# Altium project mainbroad.PrjPCB
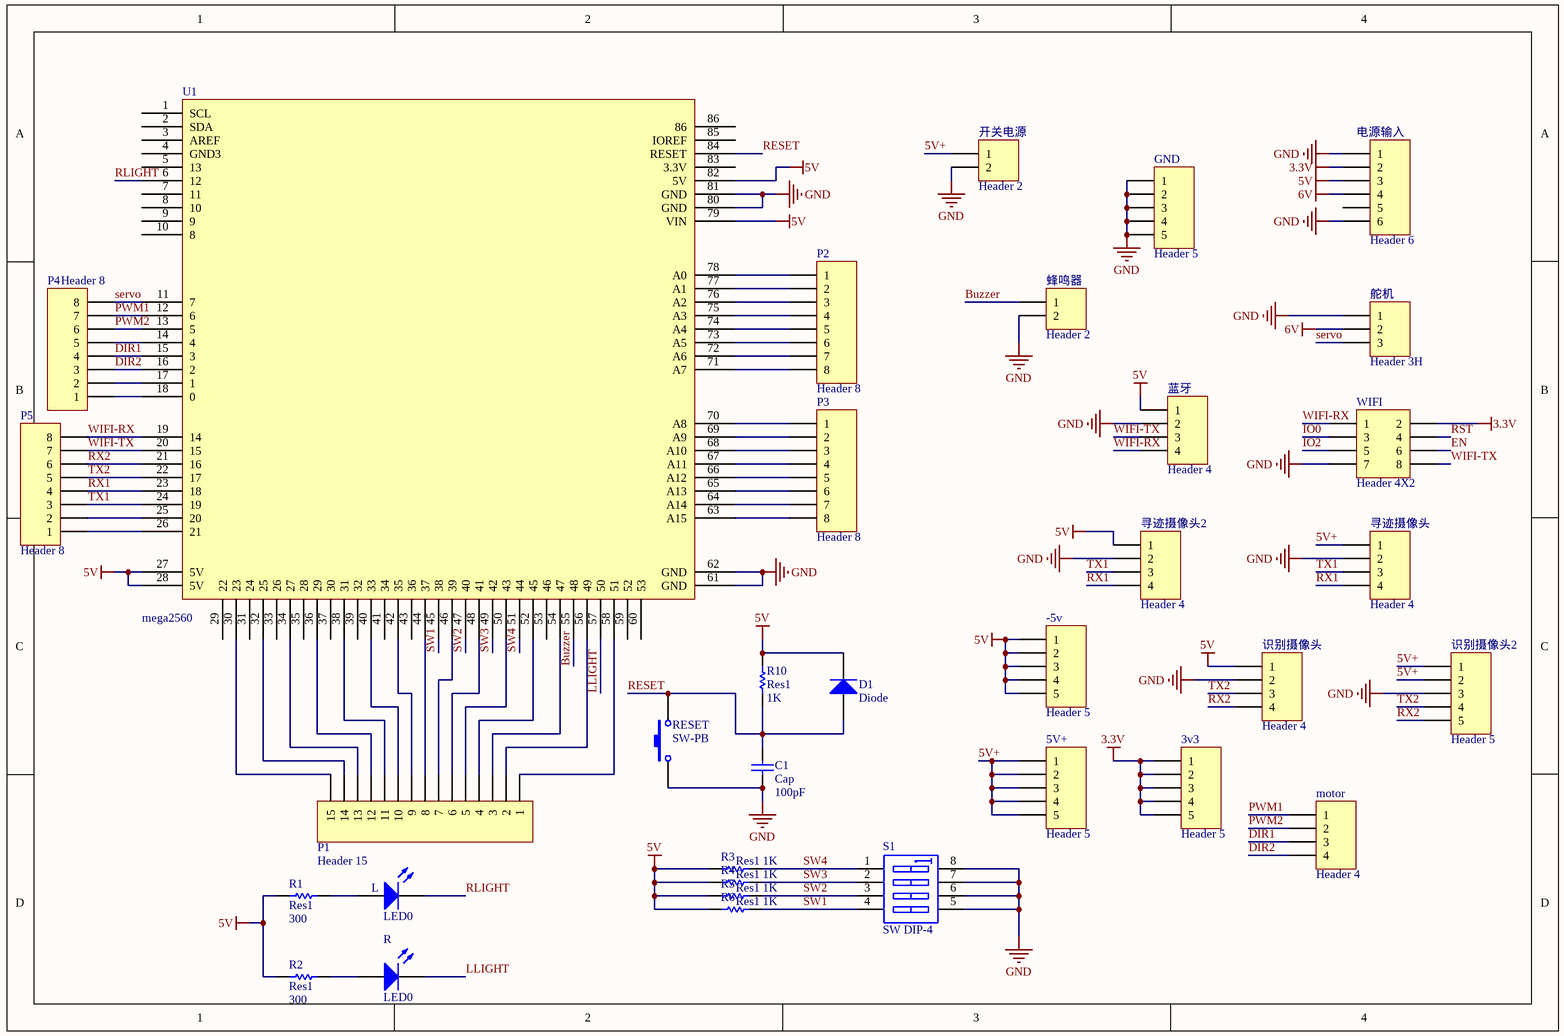
[diagram p0: mainborad.SchDoc]
Title: 主板
1 sheet, 34 parts. Net scope: global (net labels, ports and power ports of the same name join across sheets).
Board file: mainbroad.PcbDoc

## Sheet mainborad.SchDoc: 主板
size A4

### Parts
3v3  Header 5  [HDR1X5]
5V+  Header 5  [HDR1X5]
-5v  Header 5  [HDR1X5]
C1  Cap  value 100pF  [0805 - duplicate]
D1  Diode  [二极管]
GND  Header 5  [HDR1X5]
L  LED0  [LED - duplicate]
motor  Header 4  [HDR1X4]
P1  Header 15  [HDR1X15]
P2  Header 8  [HDR1X8]
P3  Header 8  [HDR1X8]
P4  Header 8  [HDR1X8]
P5  Header 8  [HDR1X8]
R  LED0  [LED - duplicate]
R1  Res1  value 300  [0805]
R2  Res1  value 300  [0805]
R3  Res1  value 1K  [0805]
R4  Res1  value 1K  [0805]
R5  Res1  value 1K  [0805]
R6  Res1  value 1K  [0805]
R10  Res1  value 1K  [0805]
RESET  SW-PB  [按钮]
S1  SW DIP-4  [BM]
U1  mega2560  [mega2560]
WIFI  Header 4X2  [HDR2X4]
寻迹摄像头  Header 4  [HDR1X4]
寻迹摄像头2  Header 4  [HDR1X4]
开关电源  Header 2  [端子]
电源输入  Header 6  [HDR1X6]
舵机  Header 3H  [HDR1X3]
蓝牙  Header 4  [HDR1X4]
蜂鸣器  Header 2  [蜂鸣器]
识别摄像头  Header 4  [HDR1X4]
识别摄像头2  Header 5  [HDR1X5]

### Nets
3.3V: 3v3.1 3v3.2 3v3.3 3v3.4 3v3.5 WIFI.2 电源输入.2
5V: -5v.1 -5v.2 -5v.3 -5v.4 -5v.5 D1.2(K) R1.1 R2.1 R3.1 R4.1 R5.1 R6.1 R10.2 U1.27(5V) U1.28(5V) U1.79(VIN) U1.82(5V) 寻迹摄像头2.1 电源输入.3 蓝牙.1 识别摄像头.1
6V: 电源输入.4 舵机.2
GND: C1.1 GND.1 GND.2 GND.3 GND.4 GND.5 RESET.1 S1.5(B4) S1.6(B3) S1.7(B2) S1.8(B1) U1.61(GND) U1.62(GND) U1.80(GND) U1.81(GND) WIFI.7 寻迹摄像头.2 寻迹摄像头2.2 开关电源.2 电源输入.1 电源输入.6 舵机.1 蓝牙.2 蜂鸣器.2 识别摄像头.2 识别摄像头2.3
5V+: 5V+.1 5V+.2 5V+.3 5V+.4 5V+.5 寻迹摄像头.1 开关电源.1 识别摄像头2.1 识别摄像头2.2
Buzzer: U1.55(48) 蜂鸣器.1
DIR1: motor.3 P4.4 U1.15(3)
DIR2: motor.4 P4.3 U1.16(2)
EN: WIFI.6
IO0: WIFI.3
IO2: WIFI.5
LLIGHT: R.2(K) U1.57(50)
PWM1: motor.1 P4.7 U1.12(6)
PWM2: motor.2 P4.6 U1.13(5)
RESET: C1.2 D1.1(A) R10.1 RESET.2 U1.84(RESET)
RLIGHT: L.2(K) U1.6(12)
RST: WIFI.4
RX1: P5.4 U1.23(18) 寻迹摄像头.4 寻迹摄像头2.4
RX2: P5.6 U1.21(16) 识别摄像头.4 识别摄像头2.5
servo: P4.8 U1.11(7) 舵机.3
SW1: R6.2 S1.4(A4) U1.45(38)
SW2: R5.2 S1.3(A3) U1.47(40)
SW3: R4.2 S1.2(A2) U1.49(42)
SW4: R3.2 S1.1(A1) U1.51(44)
TX1: P5.3 U1.24(19) 寻迹摄像头.3 寻迹摄像头2.3
TX2: P5.5 U1.22(17) 识别摄像头.3 识别摄像头2.4
WIFI-RX: P5.8 U1.19(14) WIFI.1 蓝牙.4
WIFI-TX: P5.7 U1.20(15) WIFI.8 蓝牙.3
NetL_1: L.1(A) R1.2
NetP1_1: P1.1 U1.58(51)
NetP1_2: P1.2 U1.56(49)
NetP1_3: P1.3 U1.54(47)
NetP1_4: P1.4 U1.52(45)
NetP1_5: P1.5 U1.50(43)
NetP1_6: P1.6 U1.48(41)
NetP1_7: P1.7 U1.46(39)
NetP1_8: P1.8 U1.44(37)
NetP1_9: P1.9 U1.42(35)
NetP1_10: P1.10 U1.40(33)
NetP1_11: P1.11 U1.38(31)
NetP1_12: P1.12 U1.36(29)
NetP1_13: P1.13 U1.34(27)
NetP1_14: P1.14 U1.32(25)
NetP1_15: P1.15 U1.30(23)
NetP2_1: P2.1 U1.78(A0)
NetP2_2: P2.2 U1.77(A1)
NetP2_3: P2.3 U1.76(A2)
NetP2_4: P2.4 U1.75(A3)
NetP2_5: P2.5 U1.74(A4)
NetP2_6: P2.6 U1.73(A5)
NetP2_7: P2.7 U1.72(A6)
NetP2_8: P2.8 U1.71(A7)
NetP3_1: P3.1 U1.70(A8)
NetP3_2: P3.2 U1.69(A9)
NetP3_3: P3.3 U1.68(A10)
NetP3_4: P3.4 U1.67(A11)
NetP3_5: P3.5 U1.66(A12)
NetP3_6: P3.6 U1.65(A13)
NetP3_7: P3.7 U1.64(A14)
NetP3_8: P3.8 U1.63(A15)
NetP4_1: P4.1 U1.18(0)
NetP4_2: P4.2 U1.17(1)
NetP4_5: P4.5 U1.14(4)
NetP5_1: P5.1 U1.26(21)
NetP5_2: P5.2 U1.25(20)
NetR_1: R.1(A) R2.2

Not connected (* = marked no-connect by the designer): U1 1(SCL) 2(SDA) 3(AREF) 4(GND3) 5(13) 7(11) 8(10) 9 10(8) 29(22) 31(24) 33(26) 35(28) 37(30) 39(32) 41(34) 43(36) 53(46) 59(52) 60(53) 83(3.3V) 85(IOREF) 86; 电源输入 5

### Library data of the parts
3v3 5V+ -5v GND 识别摄像头2 = Header 5: Header, 5-Pin; LatestRevisionDate: 17-Jul-2002; LatestRevisionNote: Re-released for DXP Platform.; Publisher: Altium Limited
C1 = Cap: Capacitor; Published: 8-Jun-2000; LatestRevisionDate: 17-Jul-2002; LatestRevisionNote: Re-released for DXP Platform.; PackageReference: RAD-0.3; Publisher: Altium Limited; PackageDescription: Radial Cap, Thru-Hole; 2 Leads; 0.3 in Pin Spacing
D1 = Diode: Default Diode; pin to pad: 1>2 2>1; Published: 8-Jun-2000; LatestRevisionDate: 17-Jul-2002; LatestRevisionNote: Re-released for DXP Platform.; PackageVersion: Sep-1996; PackageReference: SMC; Publisher: Altium Limited; PackageDescription: DO-214-AB/SMC; 2 C-Bend Leads; Body 7.9 x 5.9 mm, inc. leads (LxW); Code_JEDEC: DO-214-AB
L R = LED0: Typical INFRARED GaAs LED; Published: 8-Jun-2000; LatestRevisionDate: 08-Jul-2005; LatestRevisionNote: Mech Layer 1 removed.; PackageReference: LED-0; Publisher: Altium Limited; PackageDescription: LED; 2 Leads
motor 寻迹摄像头 寻迹摄像头2 蓝牙 识别摄像头 = Header 4: Header, 4-Pin; LatestRevisionDate: 17-Jul-2002; LatestRevisionNote: Re-released for DXP Platform.; Publisher: Altium Limited
P1 = Header 15: Header, 15-Pin; LatestRevisionDate: 17-Jul-2002; LatestRevisionNote: Re-released for DXP Platform.; Publisher: Altium Limited
P2-P5 = Header 8: Header, 8-Pin; LatestRevisionDate: 17-Jul-2002; LatestRevisionNote: Re-released for DXP Platform.; Publisher: Altium Limited
R1-R6 R10 = Res1: Resistor; Published: 8-Jun-2000; LatestRevisionDate: 17-Jul-2002; LatestRevisionNote: Re-released for DXP Platform.; PackageReference: AXIAL-0.3; Publisher: Altium Limited; PackageDescription: Axial Device, Thru-Hole; 2 Leads; 0.3 in Pin Spacing
RESET = SW-PB: Switch; Published: 24-Mar-1999; LatestRevisionDate: 17-Jul-2002; LatestRevisionNote: Re-released for DXP Platform.; PackageReference: SPST-2; Publisher: Altium Limited; PackageDescription: Switch; 2 Leads
S1 = SW DIP-4: DIP Switch, 4 Position, SPST; Published: 24-Mar-1999; LatestRevisionDate: 29-May-2009; LatestRevisionNote: IPC-7351 Footprint Added.; PackageVersion: Dec-2002; PackageReference: SO8; Publisher: Altium Limited; PackageDescription: 8-Pin Small Outline Integrated Circuit 1.27 mm Pitch; Code_JEDEC: MS-012-AA; Code_IPC: SOIC127P600-8
WIFI = Header 4X2: Header, 4-Pin, Dual row; LatestRevisionDate: 17-Jul-2002; LatestRevisionNote: Re-released for DXP Platform.; Publisher: Altium Limited
开关电源 蜂鸣器 = Header 2: Header, 2-Pin; LatestRevisionDate: 17-Jul-2002; LatestRevisionNote: Re-released for DXP Platform.; Publisher: Altium Limited
电源输入 = MHDR1X6: Header, 6-Pin; LatestRevisionDate: 17-Jul-2002; LatestRevisionNote: Re-released for DXP Platform.; Publisher: Altium Limited
舵机 = Header 3H: Header, 3-Pin, Right Angle; LatestRevisionDate: 17-Jul-2002; LatestRevisionNote: Re-released for DXP Platform.; Publisher: Altium Limited